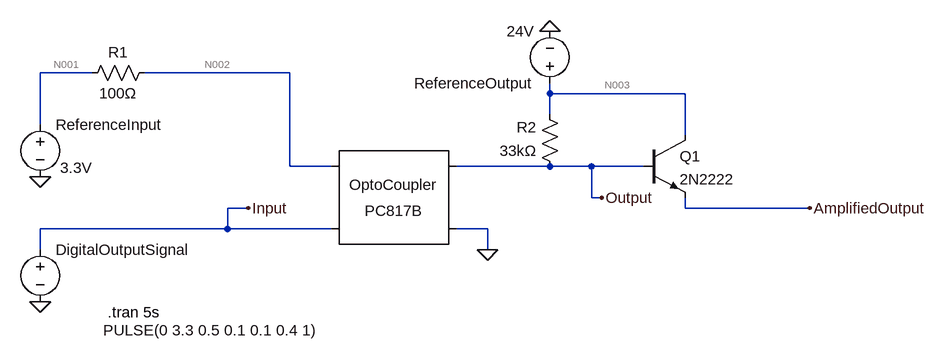
[diagram p0: schematic Conversao_3.3-24.asc]
Conversao_3.3-24.asc, the LTspice schematic file:
Version 4
SHEET 1 1168 684
WIRE -240 16 -320 16
WIRE 64 16 -160 16
WIRE 464 48 464 32
WIRE 672 48 464 48
WIRE 464 80 464 48
WIRE -320 96 -320 16
WIRE 672 112 672 48
WIRE 64 160 64 16
WIRE 128 160 64 160
WIRE 464 160 320 160
WIRE 528 160 464 160
WIRE 608 160 528 160
WIRE 528 208 528 160
WIRE 544 208 528 208
WIRE 0 224 -32 224
WIRE 672 224 672 208
WIRE 864 224 672 224
WIRE -32 256 -32 224
WIRE -32 256 -320 256
WIRE 128 256 -32 256
WIRE 368 256 320 256
WIRE -320 288 -320 256
WIRE 368 288 368 256
FLAG 368 288 0
FLAG 464 -48 0
FLAG 544 208 Output
FLAG -320 368 0
FLAG -320 176 0
FLAG 864 224 AmplifiedOutput
FLAG 0 224 Input
SYMBOL Optos\\PC817B 224 208 R0
SYMATTR InstName OptoCoupler
SYMBOL res -144 0 R90
WINDOW 0 0 56 VBottom 2
WINDOW 3 32 56 VTop 2
SYMATTR InstName R1
SYMATTR Value 100Ω
SYMBOL voltage -320 272 R0
WINDOW 123 0 0 Left 0
WINDOW 39 0 0 Left 0
WINDOW 3 97 140 Left 2
SYMATTR Value PULSE(0 3.3 0.5 0.1 0.1 0.4 1)
SYMATTR InstName DigitalOutputSignal
SYMBOL voltage 464 48 R180
WINDOW 123 0 0 Left 0
WINDOW 39 0 0 Left 0
SYMATTR InstName ReferenceOutput
SYMATTR Value 24V
SYMBOL res 480 176 R180
WINDOW 0 36 76 Left 2
WINDOW 3 36 40 Left 2
SYMATTR InstName R2
SYMATTR Value 33kΩ
SYMBOL npn 608 112 R0
SYMATTR InstName Q1
SYMATTR Value 2N2222
SYMBOL voltage -320 80 R0
WINDOW 3 31 82 Left 2
SYMATTR Value 3.3V
SYMATTR InstName ReferenceInput
TEXT -216 384 Left 2 !.tran 5s

The netlist it stands for:
* Conversao_3.3-24.asc
XOptoCoupler N002 Input Output 0 PC817 Igain=1.5m
R1 N002 N001 100Ω
V§DigitalOutputSignal Input 0 PULSE(0 3.3 0.5 0.1 0.1 0.4 1)
V§ReferenceOutput N003 0 24V
R2 Output N003 33kΩ
Q1 N003 Output AmplifiedOutput 0 2N2222
V§ReferenceInput N001 0 3.3V
.model NPN NPN
.model PNP PNP
.lib standard.bjt
.tran 5s
.lib PC817.sub
.backanno
.end

* Results of the author's LTspice run, read from the files saved beside the schematic
* Operating Point, zero values left out:
*   V(n002) = 1.135 V
*   V(output) = 66.23 mV
*   V(n001) = 3.3 V
*   V(n003) = 24 V
*   V(amplifiedoutput) = 75.07 mV
*   Ic(Q1) = 23.95 pA
*   Ib(Q1) = -23.95 pA
*   I(R1) = -21.65 mA
*   I(R2) = -725.3 µA
*   I(Digitaloutputsignal) = 21.65 mA
*   I(Referenceoutput) = -725.3 µA
*   I(Referenceinput) = -21.65 mA
*   Ix(optocoupler:1) = 21.65 mA
*   Ix(optocoupler:2) = -21.65 mA
*   Ix(optocoupler:3) = 725.3 µA
*   Ix(optocoupler:4) = -725.3 µA
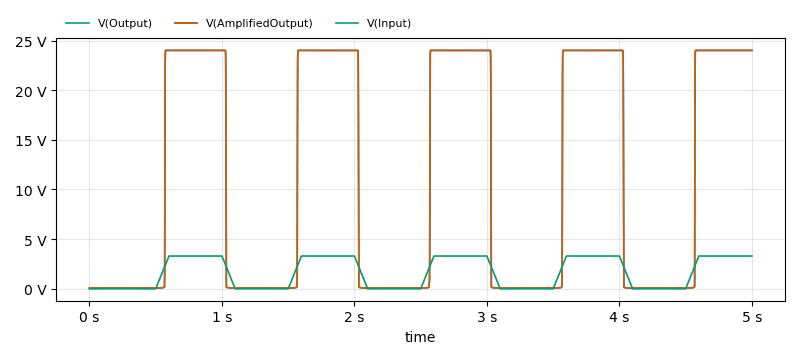
[diagram p1: Transient Analysis of Conversao_3.3-24.asc, plotted from the saved traces]
* Transient Analysis, 1 run:
*   V(Output): min 66.23 mV, max 24 V, average 10.96 V, rms 16.17 V, last 24 V
*   V(AmplifiedOutput): min 74.08 mV, max 24.01 V, average 10.97 V, rms 16.17 V, last 24.01 V
*   V(Input): min 0 V, max 3.3 V, average 1.617 V, rms 2.239 V, last 3.3 V